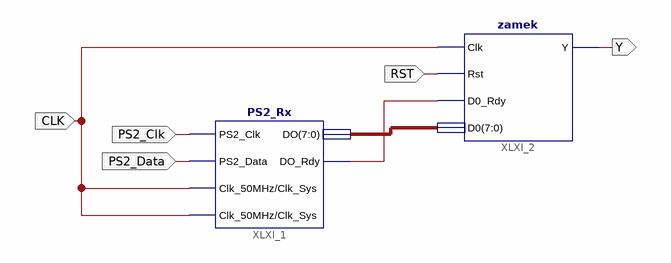
[diagram p0: schematic sheet 1]
// Xilinx ISE schematic schemat.sch (spartan3e) as structural Verilog: 2 symbols, 5 ports
module schemat (
  input  CLK,
  input  PS2_Clk,
  input  PS2_Data,
  input  RST,
  output Y
);

  wire XLXN_2;
  wire [7:0] XLXN_1;

  PS2_Rx XLXI_1 (.PS2_Clk(PS2_Clk), .PS2_Data(PS2_Data), .Clk_50MHz(CLK), .Clk_Sys(CLK), .DO_Rdy(XLXN_2), .DO(XLXN_1));
  zamek XLXI_2 (.Clk(CLK), .Rst(RST), .D0_Rdy(XLXN_2), .D0(XLXN_1), .Y(Y));
endmodule
